# EAGLE design ver1 (EAGLE 7.4.0)
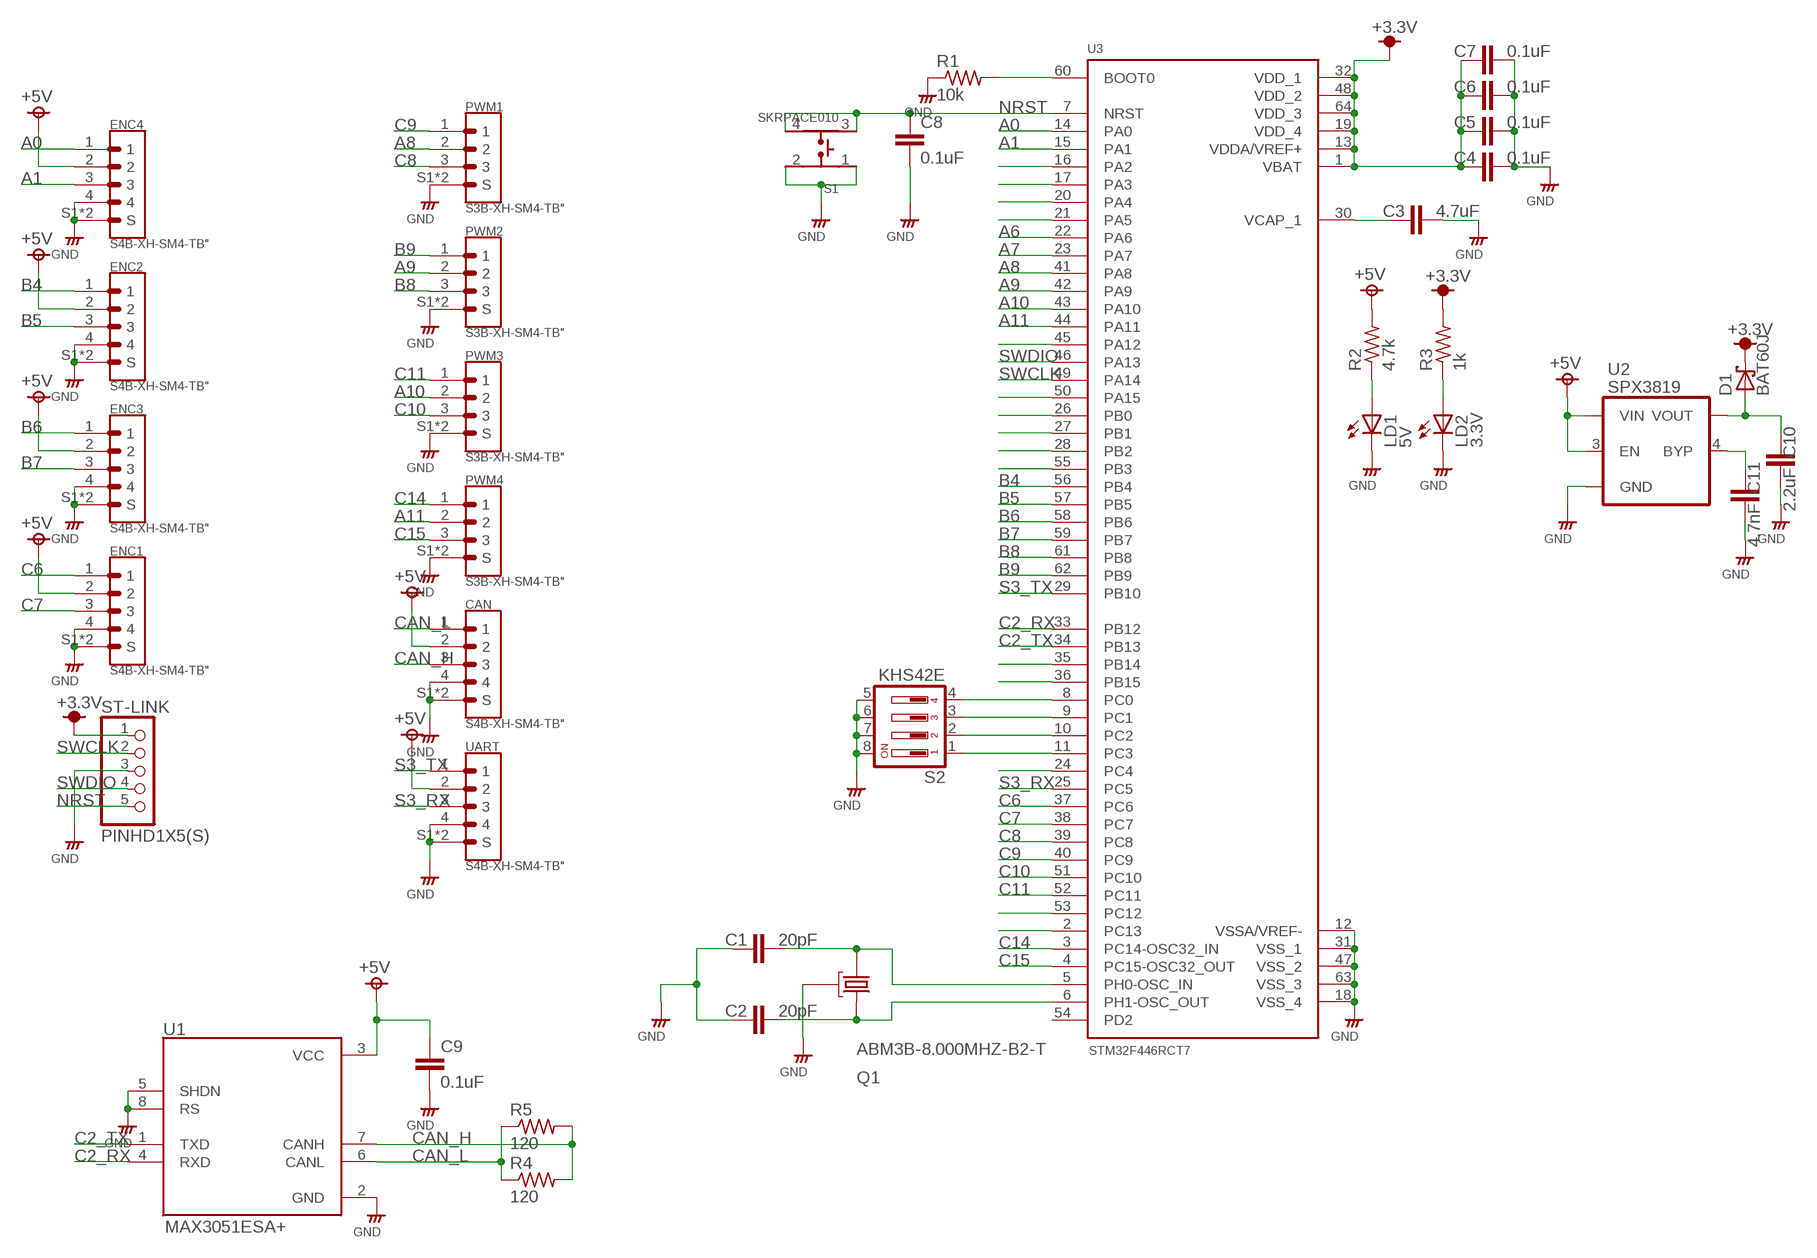
[diagram p0: schematic, sheet 1]

## Parts
C1  20pF  C-EUC0603  [C0603]
C2  20pF  C-EUC0603  [C0603]
C3  4.7uF  C-EUC0805  [C0805]
C4  0.1uF  C-EUC0805  [C0805]
C5  0.1uF  C-EUC0805  [C0805]
C6  0.1uF  C-EUC0805  [C0805]
C7  0.1uF  C-EUC0805  [C0805]
C8  0.1uF  C-EUC0603  [C0603]
C9  0.1uF  C-EUC0603  [C0603]
C10  2.2uF  C-EUC0603  [C0603]
C11  4.7nF  C-EUC0603  [C0603]
CAN  S4B-XH-SM4-TB"  [S4B-XH-SM4-TB]
D1  BAT60J  [SOD323_ST]
ENC1  S4B-XH-SM4-TB"  [S4B-XH-SM4-TB]
ENC2  S4B-XH-SM4-TB"  [S4B-XH-SM4-TB]
ENC3  S4B-XH-SM4-TB"  [S4B-XH-SM4-TB]
ENC4  S4B-XH-SM4-TB"  [S4B-XH-SM4-TB]
LD1  5V  LEDCHIP-LED3216  [CHIP-LED3216]
LD2  3.3V  LEDCHIP-LED3216  [CHIP-LED3216]
PWM1  S3B-XH-SM4-TB"  [S3B-XH-SM4-TB]
PWM2  S3B-XH-SM4-TB"  [S3B-XH-SM4-TB]
PWM3  S3B-XH-SM4-TB"  [S3B-XH-SM4-TB]
PWM4  S3B-XH-SM4-TB"  [S3B-XH-SM4-TB]
Q1  ABM3B-8.000MHZ-B2-T  [OSCCC500X320X110-4N]
R1  10k  R-US_R0603  [R0603]
R2  4.7k  R-US_R0603  [R0603]
R3  1k  R-US_R0603  [R0603]
R4  120  R-US_R0603  [R0603]
R5  120  R-US_R0603  [R0603]
S1  SKRPACE010  [SW_SKRPACE010]
S2  KHS42E  [KHS42E]
ST-LINK  PINHD1X5(S)  [1X5(XH_S)]
U1  MAX3051ESA+  [SOIC127P600X175-8N]
U2  SPX3819  [SOT23-5]
U3  STM32F446RCT7  [QFP50P1200X1200X160-64N]
UART  S4B-XH-SM4-TB"  [S4B-XH-SM4-TB]

## Nets
+3V3: C4.1 C5.1 C6.1 C7.1 D1.C R3.2 ST-LINK.1 U3.1(VBAT) U3.13(VDDA/VREF+) U3.19(VDD_4) U3.32(VDD_1) U3.48(VDD_2) U3.64(VDD_3) ; supply symbol labelled +3.3V
+5V: C9.1 CAN.2 ENC1.2 ENC2.2 ENC3.2 ENC4.2 R2.2 U1.3(VCC) U2.1(VIN) U2.3(EN) UART.2
A0: ENC4.1 U3.14(PA0)
A1: ENC4.3 U3.15(PA1)
A6: U3.22(PA6)
A7: U3.23(PA7)
A8: PWM1.2 U3.41(PA8)
A9: PWM2.2 U3.42(PA9)
A10: PWM3.2 U3.43(PA10)
A11: PWM4.2 U3.44(PA11)
B4: ENC2.1 U3.56(PB4)
B5: ENC2.3 U3.57(PB5)
B6: ENC3.1 U3.58(PB6)
B7: ENC3.3 U3.59(PB7)
B8: PWM2.3 U3.61(PB8)
B9: PWM2.1 U3.62(PB9)
C2_RX: U1.4(RXD) U3.33(PB12)
C2_TX: U1.1(TXD) U3.34(PB13)
C6: ENC1.1 U3.37(PC6)
C7: ENC1.3 U3.38(PC7)
C8: PWM1.3 U3.39(PC8)
C9: PWM1.1 U3.40(PC9)
C10: PWM3.3 U3.51(PC10)
C11: PWM3.1 U3.52(PC11)
C14: PWM4.1 U3.3(PC14-OSC32_IN)
C15: PWM4.3 U3.4(PC15-OSC32_OUT)
CAN_H: CAN.3 R4.2 R5.2 U1.7(CANH)
CAN_L: CAN.1 R4.1 R5.1 U1.6(CANL)
GND: C1.1 C2.1 C3.2 C4.2 C5.2 C6.2 C7.2 C8.2 C9.2 C10.2 C11.2 CAN.4 CAN.S1(S) CAN.S2(S) ENC1.4 ENC1.S1(S) ENC1.S2(S) ENC2.4 ENC2.S1(S) ENC2.S2(S) ENC3.4 ENC3.S1(S) ENC3.S2(S) ENC4.4 ENC4.S1(S) ENC4.S2(S) LD1.C LD2.C PWM1.S1(S) PWM1.S2(S) PWM2.S1(S) PWM2.S2(S) PWM3.S1(S) PWM3.S2(S) PWM4.S1(S) PWM4.S2(S) Q1.2(GND) Q1.4(GND) R1.1 S1.1 S1.2 S2.5 S2.6 S2.7 S2.8 ST-LINK.3 U1.2(GND) U1.5(SHDN) U1.8(RS) U2.2(GND) U3.12(VSSA/VREF-) U3.18(VSS_4) U3.31(VSS_1) U3.47(VSS_2) U3.63(VSS_3) UART.4 UART.S1(S) UART.S2(S)
N$1: C1.2 Q1.1 U3.5(PH0-OSC_IN)
N$2: C2.2 Q1.3 U3.6(PH1-OSC_OUT)
N$4: R1.2 U3.60(BOOT0)
N$6: U3.16(PA2)
N$7: U3.17(PA3)
N$8: U3.20(PA4)
N$9: U3.21(PA5)
N$11: C3.1 U3.30(VCAP_1)
N$14: LD1.A R2.1
N$15: LD2.A R3.1
N$16: U3.45(PA12)
N$17: C11.1 U2.4(BYP)
N$18: C10.1 D1.A U2.5(VOUT)
N$19: U3.50(PA15)
N$20: U3.26(PB0)
N$21: U3.27(PB1)
N$22: U3.28(PB2)
N$23: U3.55(PB3)
N$33: U3.35(PB14)
N$34: U3.36(PB15)
N$35: S2.4 U3.8(PC0)
N$36: S2.3 U3.9(PC1)
N$37: S2.2 U3.10(PC2)
N$38: S2.1 U3.11(PC3)
N$39: U3.24(PC4)
N$47: U3.53(PC12)
N$48: U3.2(PC13)
NRST: C8.1 S1.3 S1.4 ST-LINK.5 U3.7(NRST)
S3_RX: U3.25(PC5) UART.3
S3_TX: U3.29(PB10) UART.1
SWCLK: ST-LINK.2 U3.49(PA14)
SWDIO: ST-LINK.4 U3.46(PA13)
Unconnected: U3.54(PD2)

## Library data of the parts
C1-C11 = rcl:C-EU: CAPACITOR, European symbol
CAN ENC1-ENC4 UART = SxxB-XH-SM4-TB:S4B-XH-SM4-TB
D1 = diode:BAT60J: Schottky barrier diode Source: www.st.com, BAT60J.pdf
LD1 LD2 = led:LED: LED OSRAM: - CHIPLED LG R971, LG N971, LY N971, LG Q971, LY Q971, LO R971, LY R971 LH N974, LH R974 LS Q976, LO Q976, LY Q976 LO Q996 - Hyper CHIPLED LW Q18S LB Q993, LB Q99A, LB R99A - SideLED LS A670, LO A670, LY A670, LG A670, LP A670 LB A673, LV A673, LT A673, LW A673 LH A674 LY A675 LS A676, LA A676, LO A676, LY A676, LW A676 LS A679, LY A679, LG A679 - Hyper Micro SIDELED® LS Y876, LA Y876, LO Y876, LY Y876 LT Y87S - SmartLED LW L88C, LW L88S LB L89C, LB L89S, LG L890 LS L89K, LO L89K, LY L89K LS L896, LA L896, LO L896, LY L896 - TOPLED LS T670, LO T670, LY T670, LG T670, LP T670 LSG T670, LSP T670, LSY T670, LOP T670, LYG T670 LG T671, LOG T671, LSG T671 LB T673, LV T673, LT T673, LW T673 LH T674 LS T676, LA T676, LO T676, LY T676, LB T676, LH T676, LSB T676, LW T676 LB T67C, LV T67C, LT T67C, LS T67K, LO T67K, LY T67K, LW E67C LS E67B, LA E67B, LO E67B, LY E67B, LB E67C, LV E67C, LT E67C LW T67C LS T679, LY T679, LG T679 LS T770, LO T770, LY T770, LG T770, LP T770 LB T773, LV T773, LT T773, LW T773 LH T774 LS E675, LA E675, LY E675, LS T675 LS T776, LA T776, LO T776, LY T776, LB T776 LHGB T686 LT T68C, LB T68C - Hyper Mini TOPLED® LB M676 - Mini TOPLED Santana® LG M470 LS M47K, LO M47K, LY M47K Source: http://www.osram.convergy.de LUXEON: - LUMILED® LXK2-PW12-R00, LXK2-PW12-S00, LXK2-PW14-U00, LXK2-PW14-V00 LXK2-PM12-R00, LXK2-PM12-S00, LXK2-PM14-U00 LXK2-PE12-Q00, LXK2-PE12-R00, LXK2-PE12-S00, LXK2-PE14-T00, LXK2-PE14-U00 LXK2-PB12-K00, LXK2-PB12-L00, LXK2-PB12-M00, LXK2-PB14-N00, LXK2-PB14-P00, LXK2-PB14-Q00 LXK2-PR12-L00, LXK2-PR12-M00, LXK2-PR14-Q00, LXK2-PR14-R00 LXK2-PD12-Q00, LXK2-PD12-R00, LXK2-PD12-S00 LXK2-PH12-R00, LXK2-PH12-S00 LXK2-PL12-P00, LXK2-PL12-Q00, LXK2-PL12-R00 Source: www.luxeon.com KINGBRIGHT: KA-3528ASYC Source: www.kingbright.com
PWM1-PWM4 = SxxB-XH-SM4-TB:S3B-XH-SM4-TB
Q1 = ABM3B-8.000MHZ-B2-T:ABM3B-8.000MHZ-B2-T: Ceramic SMD Crystal; AVAILABILITY: Unavailable; DESCRIPTION: Crystal 8MHz ±20ppm _Tol_ ±50ppm _Stability_ 18pF FUND 200Ohm 4-Pin CSMD T/R; MF: Abracon; MP: ABM3B-8.000MHZ-B2-T; PACKAGE: SMD-4 Abracon; PRICE: None
R1-R5 = rcl:R-US_: RESISTOR, American symbol
S1 = SKRPACE010:SKRPACE010: Switch Tactile N.O. SPST Button J-Bend 0.05A 16VDC 2.55N SMD Automotive T/R; AVAILABILITY: Unavailable; DESCRIPTION: Switch Tactile N.O. SPST Button J-Bend 0.05A 16VDC 2.55N SMD Automotive T/R; MF: ALPS; MP: SKRPACE010; PACKAGE: None; PRICE: None
S2 = switch-dil:KHS42E
ST-LINK = pinhead_s:PINHD1X5(S)
U1 = MAX3051ESA_:MAX3051ESA+: CAN 1Mbps Shutdown/Standby 3.3V Extended Industrial 8-Pin SOIC N; AVAILABILITY: Unavailable; DESCRIPTION: CAN 1Mbps Shutdown/Standby 3.3V Extended Industrial 8-Pin SOIC N; MF: Maxim Integrated; MP: MAX3051ESA+; PACKAGE: SOIC-8 Maxim Integrated; PRICE: None
U2 = SPX3819:SPX3819; AVAILABILITY: Unavailable; MF: MaxLinear, Inc.; MP: SPX3819; PACKAGE: SOT-23-5 MaxLinear, Inc.; PRICE: None
U3 = STM32F446RCT7:STM32F446RCT7: 32 Bit Microcontroller, High Performance, ARM Cortex-M4, 180 MHz, 256 KB, 128 KB, 64, LQFP; AVAILABILITY: Good; DESCRIPTION: High-performance foundation line, ARM Cortex-M4 core with DSP and FPU, 256 Kbytes Flash, 180 MHz CPU, ART Accelerator...; MF: STMicroelectronics; MP: STM32F446RCT7; PACKAGE: LQFP-64 STMicroelectronics; PRICE: 5.62 USD

## Board
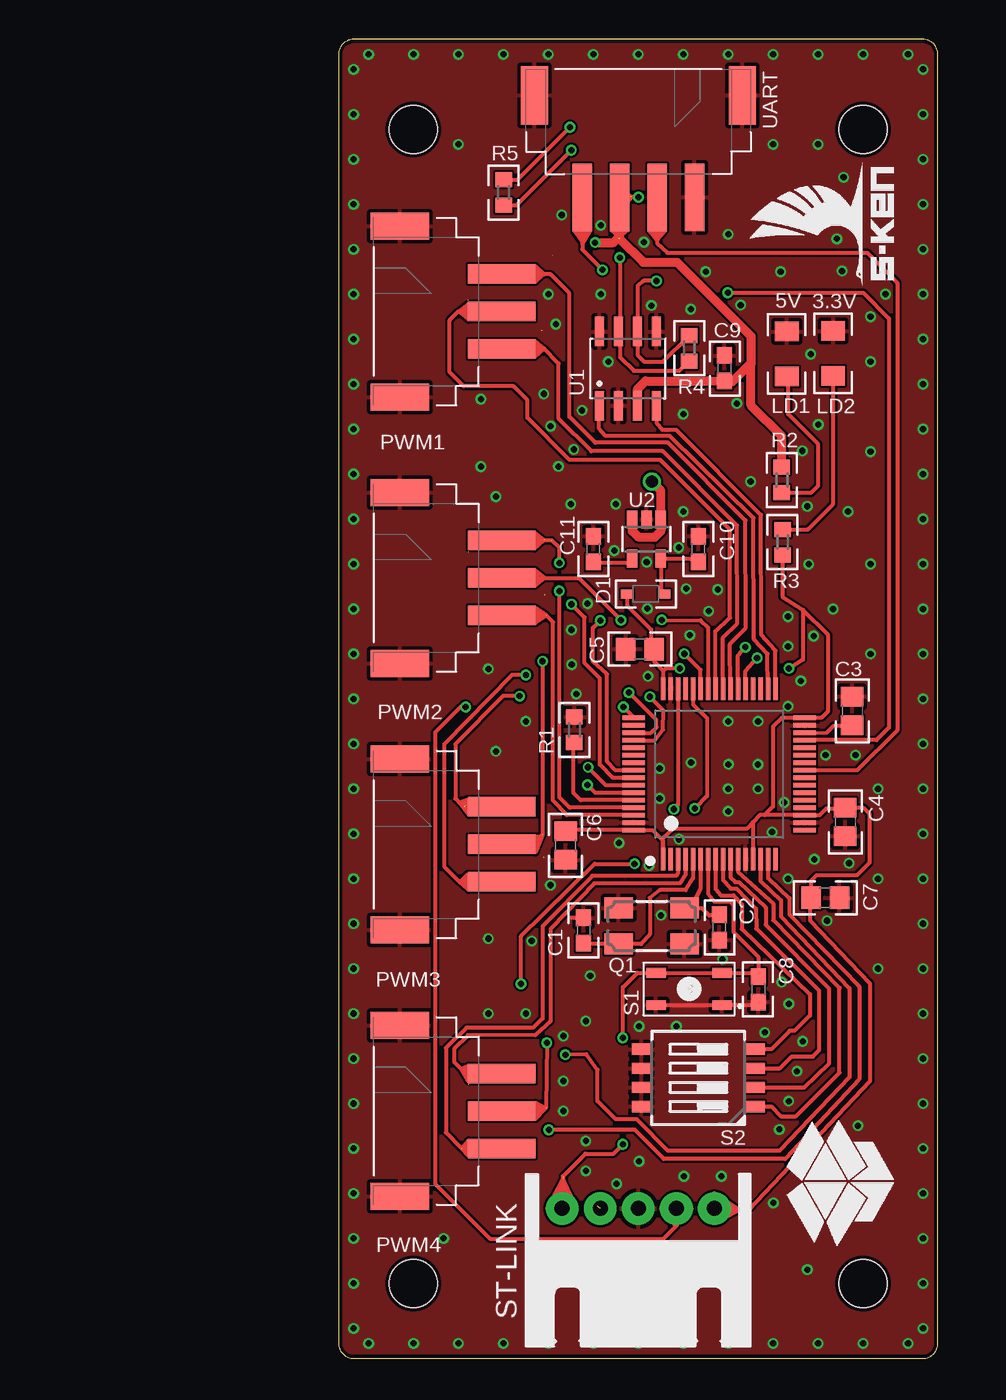
[diagram p1: board, top side]
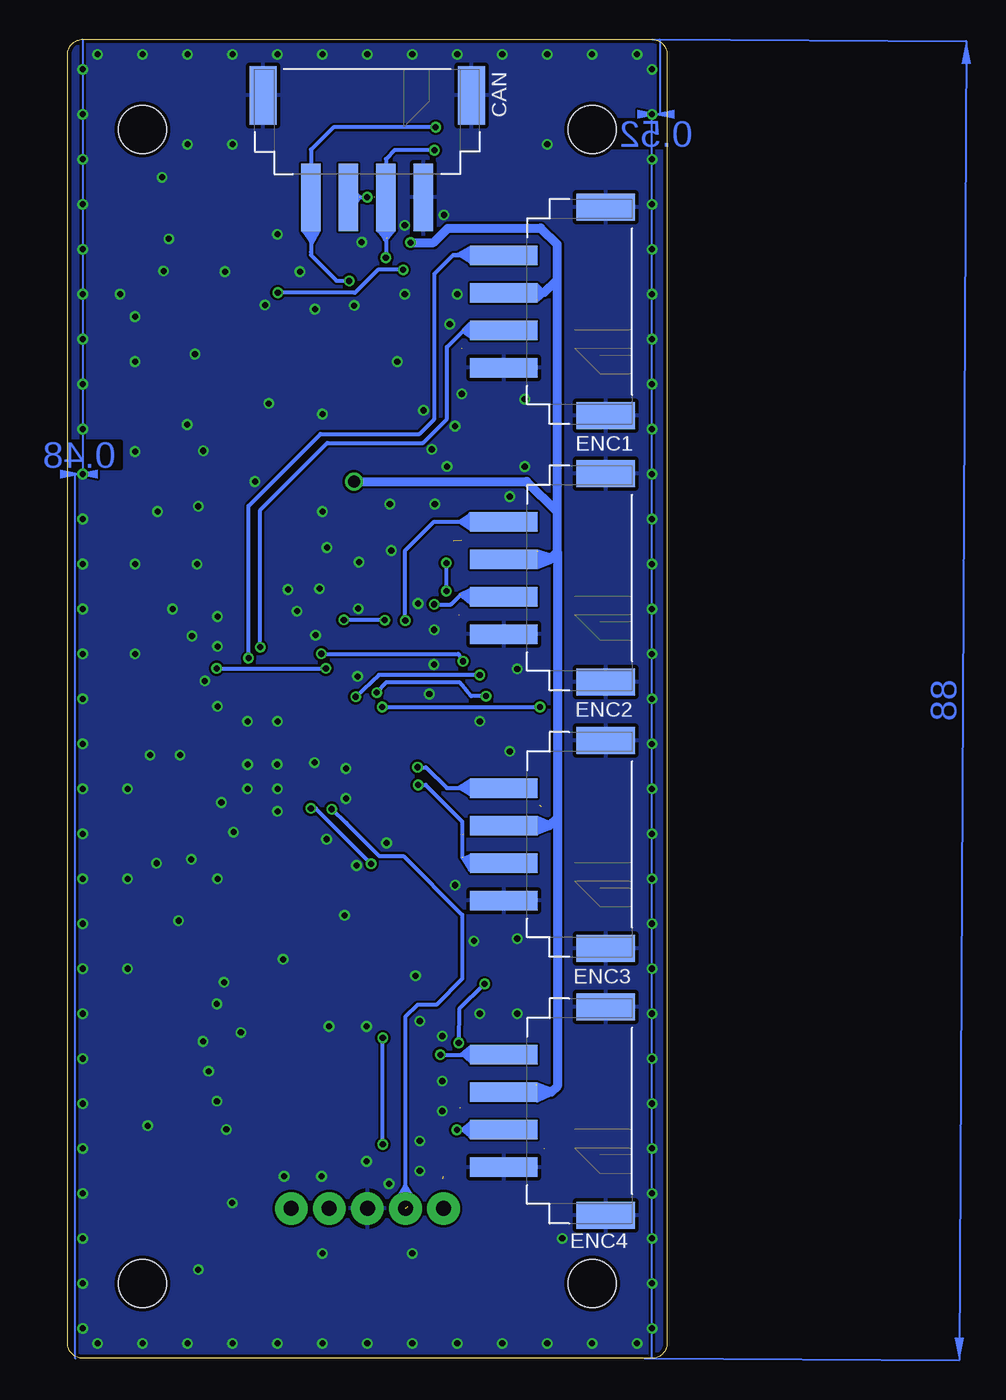
[diagram p2: board, bottom side, seen from below]

Size 40 x 88 mm. Coordinates in mm from the lower left corner, seen from the top.
Outline: 0,87 0,1 arc90 1,0 39,0 arc90 40,1 40,87 arc90 39,88 1,88 arc90 0,87
Copper layers (1*16): Top 0.035mm / dielectric 1.5mm / Bottom 0.035mm
Design rules "SeeedStudio_2layer_DRU_no_angle_20140221": minimum track width 6mil, minimum drill 12mil, track to track 6mil, track to pad 6mil, pad to pad 6mil, via to via 6mil, smd to smd 0mil, copper to edge 10mil, drill to drill 10mil, minimum pad ring 10mil, minimum via ring 6mil, stop-mask expansion 2mil, vias tented up to drill 100mil, thermal gap 10mil
Holes 3.2 mm at 5,5 5,82 35,82 35,5

### Footprints (pad centres in the part's own frame; a part is rotated, then mirrored left to right if it is on the bottom)
C0603 = smd 1.1 x 1: 1 -0.85,0; 2 0.85,0
C0805 = smd 1.3 x 1.5: 1 -0.95,0; 2 0.95,0
S4B-XH-SM4-TB = smd 1.3 x 4.5: 1 3.75,0; 2 1.25,0; 3 -1.25,0; 4 -3.75,0 | smd 1.8 x 3.9: S1 6.95,-6.8; S2 -6.95,-6.8
SOD323_ST = smd 0.8 x 0.6: A 1.25,0; C -1.25,0
CHIP-LED3216 = smd 1.6 x 1.3: A 0,-1.45; C 0,1.55
S3B-XH-SM4-TB = smd 1.3 x 4.5: 1 2.5,0; 2 0,0; 3 -2.5,0 | smd 1.8 x 3.9: S1 5.7,-6.8; S2 -5.7,-6.8
OSCCC500X320X110-4N = smd 1.9 x 1.4: 1 -2.2,-1.2; 2 2.2,-1.2; 3 2.2,1.2; 4 -2.2,1.2
R0603 = smd 1 x 1.1: 1 -0.85,0; 2 0.85,0
SW_SKRPACE010 = smd 1.3 x 0.65: 1 -2.205,1.075; 2 2.205,1.075; 3 -2.205,-1.075; 4 2.205,-1.075
KHS42E = smd 0.76 x 1.27: 1 -1.905,-3.8; 2 -0.635,-3.8; 3 0.635,-3.8; 4 1.905,-3.8; 5 1.905,3.8; 6 0.635,3.8; 7 -0.635,3.8; 8 -1.905,3.8
1X5(XH_S) = drill 1 pad 2.184: 1 -5.08,-0.001; 2 -2.54,-0.001; 3 0,-0.001; 4 2.54,-0.001; 5 5.08,-0.001
SOIC127P600X175-8N = smd 1.97 x 0.59: 1 -2.475,1.905; 2 -2.475,0.635; 3 -2.475,-0.635; 4 -2.475,-1.905; 5 2.475,-1.905; 6 2.475,-0.635; 7 2.475,0.635; 8 2.475,1.905
SOT23-5 = smd 1.2 x 0.69: 1 1.3,-0.95; 2 1.3,0; 3 1.3,0.95; 4 -1.3,0.95; 5 -1.3,-0.95
QFP50P1200X1200X160-64N = smd 1.5 x 0.3: 1 -5.7,3.75; 2 -5.7,3.25; 3 -5.7,2.75; 4 -5.7,2.25; 5 -5.7,1.75; 6 -5.7,1.25; 7 -5.7,0.75; 8 -5.7,0.25; 9 -5.7,-0.25; 10 -5.7,-0.75; 11 -5.7,-1.25; 12 -5.7,-1.75; 13 -5.7,-2.25; 14 -5.7,-2.75; 15 -5.7,-3.25; 16 -5.7,-3.75; 33 5.7,-3.75; 34 5.7,-3.25; 35 5.7,-2.75; 36 5.7,-2.25; 37 5.7,-1.75; 38 5.7,-1.25; 39 5.7,-0.75; 40 5.7,-0.25; 41 5.7,0.25; 42 5.7,0.75; 43 5.7,1.25; 44 5.7,1.75; 45 5.7,2.25; 46 5.7,2.75; 47 5.7,3.25; 48 5.7,3.75 | smd 0.3 x 1.5: 17 -3.75,-5.7; 18 -3.25,-5.7; 19 -2.75,-5.7; 20 -2.25,-5.7; 21 -1.75,-5.7; 22 -1.25,-5.7; 23 -0.75,-5.7; 24 -0.25,-5.7; 25 0.25,-5.7; 26 0.75,-5.7; 27 1.25,-5.7; 28 1.75,-5.7; 29 2.25,-5.7; 30 2.75,-5.7; 31 3.25,-5.7; 32 3.75,-5.7; 49 3.75,5.7; 50 3.25,5.7; 51 2.75,5.7; 52 2.25,5.7; 53 1.75,5.7; 54 1.25,5.7; 55 0.75,5.7; 56 0.25,5.7; 57 -0.25,5.7; 58 -0.75,5.7; 59 -1.25,5.7; 60 -1.75,5.7; 61 -2.25,5.7; 62 -2.75,5.7; 63 -3.25,5.7; 64 -3.75,5.7

### Placement (x,y rotation side)
C1  16.35,28.55 270 top
C2  25.41,28.77 90 top
C3  34.27,43.2 90 top
C4  33.81,35.8 270 top
C5  20.12,47.32 180 top
C6  15.15,34.22 270 top
C7  32.48,30.73 0 top
C8  28.01,24.62 270 top
C9  25.75,66.06 90 top
C10  24,54 90 top
C11  17,54 90 top
CAN  20.01,77.47 180 bottom
D1  20.5,51 0 top
ENC1  10.89,69.85 90 bottom
ENC2  10.89,52.07 90 bottom
ENC3  10.89,34.29 90 bottom
ENC4  10.89,16.51 90 bottom
LD1  29.91,66.97 0 top
LD2  33,67 0 top
PWM1  10.89,69.85 270 top
PWM2  10.89,52.07 270 top
PWM3  10.89,34.29 270 top
PWM4  10.89,16.51 270 top
Q1  20.89,28.85 0 top
R1  15.74,41.93 270 top
R2  29.58,58.6 90 top
R3  29.63,54.45 270 top
R4  23.4,67.4 270 top
R5  11.01,77.79 270 top
S1  23.38,24.65 180 top
S2  24.01,18.71 90 top
ST-LINK  20,10 180 top
U1  19.31,66.04 90 top
U2  20.55,54.65 90 top
U3  25.4,38.99 90 top
U$3  [SKEN_LOGO]  37.31,70.62 90 top
U$4  [BLACK_BOX]  37.89,6.6 90 top
UART  20.01,77.47 180 top

### Tracks (layer width: path | path; a pad name or v marks a point on that pad's centre or on a via)
+3V3  (via drill 0.41)
  Top 0.254: D1.C 19.25,50.24 20.85,48.64 20.85,47.54 C5.1 21.07,46.48 21.65,45.9 21.65,45.85 | 21.65,45.85 U3.48 | 33.3,36.24 C4.1 | R3.2 29.63,50.8 30.99,49.94 | C6.1 15.22,35.24 U3.64 20.94,35.24 21.64,34.54 U3.1 21.65,34.72 22.34,35.36 27.28,35.36 27.64,35.77 | 28.42,36.24 U3.19 32.1,36.24 32.56,36.7 33.76,36.7 C4.1 | 28.42,36.24 28.11,36.24 27.64,35.77 | 27.64,35.77 U3.13 | 30.99,49.94 30.99,46.62 v30.06,46.04 | v22.77,46.04 21.84,46.04 21.65,45.85 | 28.42,36.24 28.99,36.81 28.99,42.16 29.57,42.74 U3.32 31.58,42.76 32.24,42.76 32.67,43.19 32.67,48.26 30.99,49.94 | 26.74,9.92 27.37,9.92 35.47,18.5 35.47,24.99 31.49,29.2 31.49,30.7 C7.1 31.52,30.75 31.52,31.86 31.89,32.23 34.59,32.23 35.43,33.07 35.43,36.34 35.02,36.76 C4.1 | 26.74,9.92 26.7,9.92 | 26.7,9.92 25.16,9.92 ST-LINK.1 | 26.74,9.92 25.07,11.02 25.07,9.02 26.7,9.92 | 26.7,9.92 25.21,10.69 26.22,9.97 25.22,10.46 25.7,10.01 25.2,10.21 25.27,9.28 26.22,9.78 25.33,9.78 25.42,9.56 25.65,9.62
  Bottom 0.254: v30.06,46.04 v22.77,46.04
+5V  (via drill 0.41, 0.8)  (7 unrouted)
  Top 0.254: 21.05,54.8 21.08,54.77 | 18.76,75.46 UART.2 19.53,77.47 | 18.76,75.46 18.76,74.85 18.76,74.7 | C9.1 25.69,65.18 24.65,65.21 24.6,65.21 | R2.2 | 18.72,75.42 18.76,75.46 | 18.7,74.77 18.23,75.26 19.29,75.26 18.69,74.77 18.9,75.11 18.56,75.1 | v20.01,77.47 19.53,77.47 | 19.53,77.47 19.29,77.14 | 19.52,77.5 19.2,77.74
  Top 0.61: U2.3 19.6,55.2 20,54.8 21.05,54.8 | 21.08,54.77 21.5,55.2 U2.1 21.5,57.9 v20.9,58.5 | 18.76,74.7 20.33,73.13 22.58,73.13 27.52,68.19 27.52,66.4 | 27.52,66.4 26.28,65.16 24.65,65.21 | U1.3 19.95,64.67 20.49,65.21 24.6,65.21 | v17.12,74.45 18.36,74.45 18.76,74.85 | R2.2 29.57,61.52 27.52,63.57 27.52,66.4
  Bottom 0.254: ENC1.2 8.21,71.1 8.2,71.11 8.66,71.58 8.66,70.64 8.2,71.13 8.52,71.22 8.53,70.93 | ENC2.2 7.83,53.32 7.83,53.29 8.68,53.82 8.68,52.86 7.85,53.28 8.56,53.12 8.55,53.52 8.36,53.42 | ENC3.2 8.07,35.54 | 7.85,35.54 8.04,35.54 8.66,36.01 8.67,35.07 8.07,35.54 | ENC4.2 7.74,17.75 7.74,17.68 7.7,17.64 | 8.46,75.4 8.44,75.42 | 8.07,35.54 8.52,35.33 8.47,35.7 | CAN.2 20.52,77.47 | 20.52,77.47 v20.01,77.47 | 20.52,77.47 20.67,77.21 | 8.01,71.13 8.64,70.62 | 20.5,77.46 20.72,77.69 | 7.94,35.76 8.64,36.05 8.67,35.04 7.94,35.35 | 7.6,17.88 8.67,18.27 8.65,17.21 7.7,17.64 | 7.7,17.64 8.57,18.02 | 7.98,17.74 8.71,18.26 8.7,17.29 8.07,17.77 8.6,17.94 8.54,17.55 | 7.78,53.57 8.63,53.83 8.63,52.81 7.71,53.17
  Bottom 0.61: 7.33,71.98 7.33,74.31 8.44,75.42 | 8.2,71.11 7.33,71.98 | 7.33,53.82 7.33,56.45 | 7.33,56.45 7.33,71.98 | 7.83,53.32 7.33,53.82 | 7.33,53.82 7.33,36.06 | 8.07,35.54 8.04,35.54 | 7.85,35.54 7.33,36.06 | 7.33,36.06 7.33,18.16 7.74,17.75 | v17.12,74.45 15.6,74.45 14.62,75.4 8.46,75.4 | v20.9,58.5 9.38,58.5 7.33,56.45
A0  (via drill 0.41)
  Top 0.254: U3.14 28.15,31.85 29.53,30.57 29.53,29.48 34.08,24.7 34.08,18.77 29.43,13.86 21.99,13.86 19.9,15.95 18.5,15.95 17.27,17.18 17.27,19.24 17.28,19.25 16.53,20.29 v15.13,20.26
  Bottom 0.254: ENC4.1 v15.13,20.26 13.73,20.26 13.72,20.27 13.1,20.78 13.1,19.8 13.65,20.28 13.3,20.48 13.27,20.11
A1  (via drill 0.41)
  Top 0.254: U3.15 28.65,32.04 30.09,30.7 30.09,29.61 34.73,24.82 34.73,18.61 29.8,13.31 21.7,13.31 19.76,15.25 v14.03,15.25
  Bottom 0.254: v14.03,15.25 13.68,15.25 | 13.68,15.25 13.65,15.25 | 13.65,15.25 ENC4.3 | 13.68,15.25 13.11,15.72 13.12,14.8 13.65,15.25 | 13.65,15.25 13.3,15.42 13.27,15.05
A8
  Top 0.254: U3.41 25.14,48.5 26.12,49.42 26.12,55.29 21.47,59.94 15.42,59.94 12.6,62.76 12.6,63.93 11.67,64.86 8.34,64.86 7.41,65.79 7.41,69.27 7.97,69.83 | 7.97,69.83 10.87,69.83 PWM1.2 | 7.97,69.83 8.67,70.37 8.66,69.32 8,69.84 8.52,69.64 8.38,69.95 8.52,70.03
A9  (via drill 0.41)
  Top 0.254: PWM2.2 15.95,52.07 | 15.95,52.07 16.04,52.07 v18.84,49.25 | v21.57,49.27 24.16,49.24 24.65,48.75 U3.42 | 13.3,52.23 13.27,51.89 13.75,52.05 13.11,51.55 13.11,52.59 13.79,52.06 15.94,52.06 15.95,52.07
  Bottom 0.254: v18.84,49.25 v21.57,49.27
A10  (via drill 0.41)  (1 unrouted)
  Top 0.254: U3.43 24.15,45.93 v23.07,47.01 | v13.62,46.51 13.62,34.94 12.96,34.28 PWM3.2 | 13.6,34.93 13.14,33.77 13.13,34.82 13.45,34.82
  Bottom 0.254: v23.07,47.01 13.92,47.01 v13.62,46.51
A11  (via drill 0.41)  (1 unrouted)
  Top 0.254: v13.9,21.05 13.84,16.74 13.46,16.51 PWM4.2 | U3.44 23.66,43.64 24.58,42.72 24.58,37.51 v23.77,36.7 | v12.17,24.98 12.17,28.17 13.64,29.61 17.08,33 v19.75,33 | 13.81,16.69 13.13,17.04 13.13,15.98 13.83,16.72 13.32,16.76 13.32,16.37
  Bottom 0.254: v13.9,21.05 13.84,23.36 v12.17,24.98 | 19.82,33 v19.75,33 23.45,36.7 v23.77,36.7
B4  (via drill 0.41)
  Top 0.254: U3.56 18.49,39.24 17.92,39.83 17.92,45.66 16.97,46.51 16.97,48.73 v17.47,49.23
  Bottom 0.254: 13.86,55.83 15.55,55.83 17.47,53.91 v17.47,49.23 | 13.86,55.83 ENC2.1 | 13.86,55.83 13.12,56.34 13.14,55.35 13.83,55.81 13.3,56.02 13.33,55.65
B5  (via drill 0.41)  (1 unrouted)
  Top 0.254: U3.57 18.31,38.74 17.43,39.62 17.43,45.37 16.42,46.38 16.42,49.43 v15.54,50.31
  Bottom 0.254: 12.4,50.31 12.24,50.47 11.24,50.47 ENC2.3 11.01,50.94 13.79,50.94 14.42,50.31 v15.54,50.31 | 13.79,50.96 13.09,51.29 13.1,50.37 13.77,50.9 13.3,51.06 13.31,50.64 13.45,50.81 13.43,50.89
B6  (via drill 0.41)
  Top 0.254: U3.58 17.85,38.24 v16.65,39.44
  Bottom 0.254: v16.65,39.44 16.09,39.44 14.7,38.05 13.92,38.05 | 13.92,38.05 ENC3.1 | 13.92,38.05 13.1,38.55 13.1,37.61 13.83,38.06 13.29,38.28 13.25,37.87 13.49,38.19
B7  (via drill 0.41)  (1 unrouted)
  Top 0.254: U3.59 17.13,37.74 v16.61,38.26
  Bottom 0.254: v16.61,38.26 16.11,38.26 13.67,35.82 13.67,33.45 13.27,33.05 ENC3.3 | 13.62,33.37 13.15,33.52 13.15,32.62 13.66,33.43 13.3,33.27
B8  (via drill 0.41)  (1 unrouted)
  Top 0.254: U3.61 15.42,36.74 14.73,37.43 v14.73,51.2 | v14.73,53.07 14.73,54.09 14.24,54.58 PWM2.3 | 13.72,54.6 13.09,55.09 13.09,54.04 13.66,54.57 13.24,54.76 13.28,54.36
  Bottom 0.254: v14.73,51.2 v14.73,53.07
B9  (1 unrouted)
  Top 0.254: U3.62 15.24,36.24 14.31,37.22 14.31,49.12 13.86,49.57 PWM2.1 | 13.87,49.59 13.12,50.09 13.12,49.05 13.85,49.56 13.22,49.36 13.32,49.76 13.41,49.69 13.39,49.43
C2_RX
  Top 0.254: U3.33 29.15,47.22 28.22,48.26 28.19,56.27 22.52,61.96 21.6,61.96 21.22,62.41 U1.4
C2_TX
  Top 0.254: U3.34 28.62,47 27.72,47.97 27.69,56.07 22.1,61.54 17.81,61.55 17.39,62.03 U1.1
C6  (via drill 0.41)  (1 unrouted)
  Top 0.254: U3.37 27.15,45.87 v27.93,46.73
  Bottom 0.254: v27.93,46.73 27.93,56.87 23.13,61.67 16.52,61.67 15.52,62.67 15.52,72.37 14.27,73.62 13.95,73.62 | 13.95,73.62 10.91,73.62 ENC1.1 | 13.56,73.58 13.33,73.43 13.3,73.84 13.9,73.63 13.12,73.17 13.11,74.12 13.94,73.64 13.94,73.63 13.95,73.62 | 13.92,73.6 14.27,73.6 | 13.78,73.6 13.92,73.6 | 13.92,73.6 13.94,73.58 13.95,73.58
C7  (via drill 0.41)  (1 unrouted)
  Top 0.254: U3.38 26.65,46.9 v27.15,47.45
  Bottom 0.254: v27.15,47.45 27.15,56.6 22.68,61.07 16.3,61.07 14.69,62.68 14.69,67.47 13.58,68.58 10.91,68.58 ENC1.3 | 13.57,68.6 13.1,69.07 13.1,68.16 13.37,68.34 13.59,68.51 13.28,68.7 13.24,68.38
C8
  Top 0.254: U3.39 26.13,47.66 27.17,48.74 27.16,55.9 21.97,61.09 17.13,61.09 15.39,62.83 15.39,71.06 14.12,72.33 13.72,72.33 | 13.72,72.33 13.66,72.33 | 13.66,72.33 10.91,72.33 PWM1.3 | 13.72,72.33 13.13,72.87 13.13,71.83 13.66,72.33 | 13.66,72.33 13.32,72.49 13.32,72.2
C9  (1 unrouted)
  Top 0.254: U3.40 25.65,48.1 26.61,49.03 26.59,55.57 21.63,60.53 16.86,60.53 14.69,62.7 14.69,66.38 13.7,67.37 10.91,67.37 PWM1.1 | 13.72,67.38 13.1,67.87 13.1,66.83 13.69,67.34 13.27,67.54 13.3,67.21
C10  (via drill 0.41)  (1 unrouted)
  Top 0.254: U3.51 20.86,41.74 21.22,42.1 21.21,42.6 v19.38,44.42 | v12.08,44.18 10.98,44.2 7.8,40.98 7.8,37.35 8.37,36.78 PWM3.3 | 8.05,37.08 8.68,37.31 8.69,36.27 8.08,37.09 8.51,37.05 8.47,36.9 8.62,36.44
  Bottom 0.254: v12.08,44.18 13.08,44.18 13.81,45.09 18.75,45.11 v19.38,44.42
C11  (via drill 0.41)
  Top 0.254: U3.52 21.11,41.24 21.65,41.93 21.67,43.21 v20.78,44.14 | v12.5,45.59 11.58,45.6 7.04,40.97 7.04,32.83 8.08,31.79 8.09,31.79 | 8.09,31.79 PWM3.1 | 8.09,31.79 8.65,32.31 8.67,31.27 8.08,31.8 8.49,31.97 8.48,31.63
  Bottom 0.254: v12.5,45.59 19.22,45.61 v20.78,44.14
C14  (1 unrouted)
  Top 0.254: U3.3 22.65,32.4 22.54,32.19 16.94,32.19 13.62,28.82 13.62,22.67 12.96,22.06 8.53,22.06 7.17,20.7 7.17,15.07 8.22,14.02 PWM4.1 | 8.21,13.99 8.68,14.53 8.69,13.49 8.18,14.05 8.51,13.87 8.56,14.14
C15
  Top 0.254: U3.4 23.15,32.27 22.77,31.69 17.07,31.69 14.15,28.66 14.14,22.49 13.14,21.58 8.63,21.56 7.71,20.64 7.71,19.78 8.18,19.31 | 8.18,19.31 8.48,19.01 PWM4.3 | 8.18,19.31 8.64,19.52 8.64,18.5 8.18,19.3 8.44,19.25 8.51,18.81 8.59,19.27
CAN_H  (via drill 0.41)
  Top 0.254: v18.77,73.44 18.79,68.62 | 18.79,68.62 U1.7 | R5.2 11.86,76.94 v15.53,80.61 | 18.79,68.62 18.79,66.8 19.7,65.89 22.74,65.89 R4.2
  Bottom 0.254: 18.76,74.59 CAN.3 18.76,80.02 18.17,80.61 v15.53,80.61 | 18.76,74.59 18.76,73.66 v18.77,73.44 | 18.76,74.59 18.23,75.26 19.29,75.27 18.82,74.67 18.94,75.15 18.54,75.09 18.67,74.99
CAN_L  (via drill 0.41)
  Top 0.254: v21.21,71.89 20.35,71.89 19.95,71.54 U1.6 19.95,66.94 20.39,66.5 21.65,66.5 R4.1 | R5.1 11.94,78.64 v15.44,82.14
  Bottom 0.254: 23.76,73.83 CAN.1 23.76,80.65 22.27,82.14 v15.44,82.14 | 23.76,73.83 23.76,73.61 22.07,71.89 v21.21,71.89 | 23.69,74.88 23.53,75.07 23.99,75.17 23.72,74.45 24.29,75.25 23.24,75.24 23.75,74.34 23.75,73.84 23.76,73.83
GND  (via drill 0.41)
  Top 0.254: 28.19,23.59 C8.2 27.82,23.57 S1.1 S1.2 | C1.1 15.74,29.4 15.53,29.39
  other vias: 15.54,48.61 22.72,34.64 28.93,35.11 29.74,37.09 14.14,31.57 16.79,25.53 30.05,23.65 1,2 11,1 14,1 17,1 20,1 23,1 26,1 32,1 38,1 29,1 35,1 8,1 5,1 2,1 1,5 1,32 1,8 1,11 1,29 1,14 1,17 1,20 1,23 1,26 1,35 1,38 1,41 1,44 1,47 1,50 1,53 1,56 1,59 1,62 1,65 1,68 1,71 1,74 1,77 1,80 1,83 1,86 2,87 5,87 8,87 11,87 14,87 17,87 20,87 23,87 26,87 29,87 32,87 35,87 38,87 39,86 39,83 39,80 39,77 39,74 39,71 39,68 39,65 39,62 39,59 39,56 39,53 39,50 39,47 39,44 39,41 39,38 39,35 39,32 39,29 39,26 39,23 39,20 39,17 39,14 39,11 39,8 39,5 39,2 23.53,39.75 26,42.5 26.02,39.63 26,38 28,38 27.99,39.62 28,42.5 26,36.5 30,43.5 25.3,51.3 23.2,51.35 9.5,59.5 13.7,64.35 14.15,62.2 15.7,60.65 9.5,64 23,56.5 18.5,57 15.5,57 10.5,57.5 10,46 35.5,69.5 35.5,66.5 35.5,60.5 26.58,63.71 24.5,72.5 29.5,72.5 33.6,72.55 36.5,71 27.5,58.5 30,49.5 30,47.5 30.85,45.2 30,32 25.55,12.15 23.05,12.15 18.55,11.65 20.05,13.15 16.5,12.5 16.5,14.5 18.72,34.39 20.72,32.89 12.5,23 10,23 10,28 14,71 14.5,69 12.5,42.5 10.5,40.5 15,18.5 15,16.5 20.05,22.15 22.55,22.15 32.5,40.25 34.5,40.25 35.5,47 33,50 35.5,53 31.37,52.99 31.28,56.85 34,56.5 23.5,70 20.87,70.25 18,66.5 16.25,63.25 17.5,71 20.38,74.47 15,21.5 16.5,22.5 17,7 23,7 7,8 32,81 33.25,74.7 29,81 33.7,78.8 26,75 8,81 14.89,76.29 36,38 36,32 36,26 25.62,26.62 26.83,70.28 32.6,29.2 34.07,33.04 31.75,33.3 24.7,49.85 20.61,50.02 22.7,54.1 18.4,53.9 14.68,59.51 32.02,62.3 31.51,67 23,63 23.45,48.25 30.95,60.55 21.43,37.36 21.43,39.36 17.5,75.6 20.56,53.13 31.28,5.92 21.52,29.57 12.89,27.84 29.57,25.09 31.71,48.19 15.87,44.33 15.56,46.29 20.65,45.5 16.62,50.36 28.44,21.74 30.59,19.16 30.04,17.16 30.97,21.15 29.41,15.27 29.01,10.37 34.66,15.52
  pour Bottom: 40,87 40,1 arc-90 39,0 1,0 arc-90 0,1 0,87 arc-90 1,88 39,88 arc-90
  pour Top: 40,87 40,1 arc-90 39,0 1,0 arc-90 0,1 0,87 arc-90 1,88 39,88 arc-90
N$1
  Top 0.254: U3.5 23.65,32.04 23.15,31.24 21.43,31.24 20.77,30.73 20.77,28.29 20.18,27.65 Q1.1 16.7,27.65 C1.2
N$2
  Top 0.254: 25.12,30.05 C2.2 25.34,29.55 24.74,29.55 24.26,30.03 23.85,30.03 23.61,30.27 | U3.6 24.15,31.33 23.61,30.27 | 23.61,30.27 23.5,30.06 Q1.3
N$4
  Top 0.254: U3.60 16.15,37.24 15.66,37.73 15.66,40.68 R1.2
N$11
  Top 0.254: U3.30 32.57,41.75 33.05,42.21 34.24,42.21 C3.1
N$14
  Top 0.254: 29.92,58.09 R2.1 31.51,57.74 32,58.23 32,61 30,63 30,65.43 LD1.A
N$15
  Top 0.254: R3.1 31.3,55.3 33,57 LD2.A
N$17
  Top 0.254: C11.1 17.06,53.15 17.11,53.1 19.35,53.1 U2.4
N$18
  Top 0.254: D1.A 21.5,51.24 U2.5 23.8,53.35 C10.1
N$35
  Top 0.254: U3.8 25.15,31.31 25.51,30.9 26.36,30.9 26.91,30.3 26.91,28.64 31.45,24.3 31.45,22.88 30.42,21.85 30.1,21.85 28.87,20.62 S2.4
N$36
  Top 0.254: U3.9 25.65,31.92 26.18,31.34 26.56,31.34 27.85,30 27.87,28.67 32.08,24.53 32.08,20.57 31.65,20.14 30.24,20.14 29.45,19.35 S2.3
N$37
  Top 0.254: U3.10 26.15,32.1 26.47,31.78 26.71,31.78 28.51,30.08 28.51,28.93 32.74,24.64 32.74,19.69 31.08,18.08 S2.2
N$38
  Top 0.254: U3.11 26.65,32.46 29.01,30.35 29.01,29.24 33.43,24.72 33.42,24.71 33.42,19.05 30.53,16.16 29.53,16.16 28.88,16.81 S2.1
NRST  (via drill 0.41)  (1 unrouted)
  Top 0.254: 28.29,25.75 C8.1 | U3.7 24.65,31 25.06,30.49 26.1,30.49 26.35,30.19 26.35,28.45 28.01,26.79 C8.1 | C8.1 27.76,25.73 S1.3 S1.4 19.94,25.73 18.97,24.76 v18.97,21.38 | v18.97,14.28 18.35,13.66 16.47,13.66 14.96,12.15 14.96,10.04 | 14.97,11.98 13.94,10 15.9,9.98 14.98,11.94 15.66,10.11 14.25,10.14 14.85,11.36 14.8,10.27 14.53,10.28 14.68,10.67 15.11,11.21 15.39,10.37 15.11,10.23 15.12,10.81
  Top 0.305: 14.96,10.04 ST-LINK.5
  Bottom 0.254: v18.97,14.28 v18.97,21.38
S3_RX
  Top 0.254: UART.3 21.26,74.62 | 21.26,74.62 21.26,74.41 21.94,73.77 35.28,73.77 37.27,71.77 37.27,41.9 34.6,39.23 U3.25 | 21.26,74.62 20.73,75.23 21.79,75.23 21.28,74.65 21.08,75.07 21.44,75.05
S3_TX  (via drill 0.41)
  Top 0.254: UART.1 16.26,74.37 | 16.26,74.37 16.26,73.98 v17.61,72.63 | v25.97,71.1 35.01,71.1 36.73,69.38 36.73,42.08 35.9,41.25 U3.29 | 16.26,74.37 16.78,75.22 15.73,75.22 16.27,74.45 16.46,75.03 16.05,75 16.1,74.93
  Bottom 0.254: v17.61,72.63 19.3,72.63 20.83,71.1 v25.97,71.1
SWCLK  (via drill 0.41)
  Top 0.254: U3.49 19.7,42.77 v19.01,43.46 | 22.53,8.83 21.69,7.99 10.11,7.99 6.44,11.66 6.44,41.76 8.14,43.46 v8.48,43.46 | 22.53,8.83 22.55,8.85 ST-LINK.2 | 22.53,8.83 21.52,10 23.56,10 22.49,8.82 21.84,9.83 23.21,9.8 22.66,9.25 22.73,9.64 22.92,9.67 22.08,9.67 22.44,9.16 22.35,9.57
  Bottom 0.254: v19.01,43.46 v8.48,43.46
SWDIO  (via drill 0.41)  (1 unrouted)
  Top 0.254: U3.46 22.65,36.94 v22.38,36.64
  Bottom 0.254: v22.38,36.64 21.42,35.73 19.21,33.52 17.6,33.52 13.67,29.59 13.67,25.32 15.39,23.6 16.64,23.6 17.47,22.77 ST-LINK.4 | 17.46,11.48 16.5,9.99 18.43,9.98 17.49,11.49 17.29,10.14 16.76,10.14 17.23,10.94 17.06,10.27 | 17.25,10.41 17.06,10.27 | 17.06,10.27 17.96,10.17 18.16,10.12 17.91,10.43 17.66,10.95 17.68,10.38 17.83,10.28 17.89,10.34
(copper drawn outside any net)
  shapes: Bottom area x3